# Altium schematic sheet Matrix.SchDoc
size B
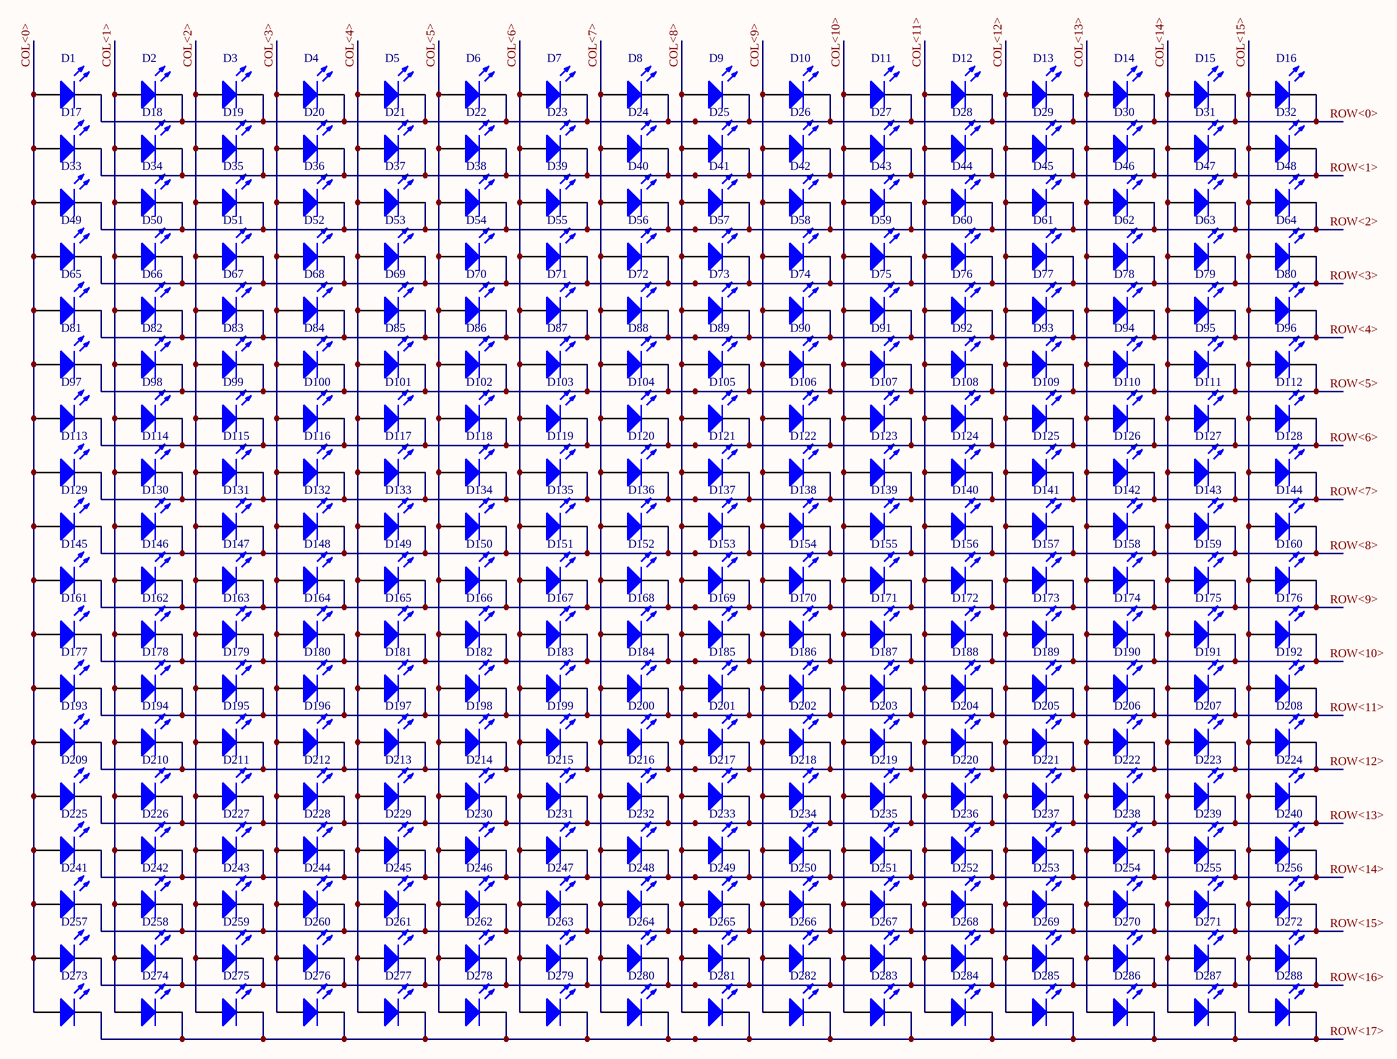
[diagram p0: Matrix.SchDoc]

## Parts
D1  (no value)  [LED-UPRIGHT]
D2  (no value)  [LED-UPRIGHT]
D3  (no value)  [LED-UPRIGHT]
D4  (no value)  [LED-UPRIGHT]
D5  (no value)  [LED-UPRIGHT]
D6  (no value)  [LED-UPRIGHT]
D7  (no value)  [LED-UPRIGHT]
D8  (no value)  [LED-UPRIGHT]
D9  (no value)  [LED-UPRIGHT]
D10  (no value)  [LED-UPRIGHT]
D11  (no value)  [LED-UPRIGHT]
D12  (no value)  [LED-UPRIGHT]
D13  (no value)  [LED-UPRIGHT]
D14  (no value)  [LED-UPRIGHT]
D15  (no value)  [LED-UPRIGHT]
D16  (no value)  [LED-UPRIGHT]
D17  (no value)  [LED-UPRIGHT]
D18  (no value)  [LED-UPRIGHT]
D19  (no value)  [LED-UPRIGHT]
D20  (no value)  [LED-UPRIGHT]
D21  (no value)  [LED-UPRIGHT]
D22  (no value)  [LED-UPRIGHT]
D23  (no value)  [LED-UPRIGHT]
D24  (no value)  [LED-UPRIGHT]
D25  (no value)  [LED-UPRIGHT]
D26  (no value)  [LED-UPRIGHT]
D27  (no value)  [LED-UPRIGHT]
D28  (no value)  [LED-UPRIGHT]
D29  (no value)  [LED-UPRIGHT]
D30  (no value)  [LED-UPRIGHT]
D31  (no value)  [LED-UPRIGHT]
D32  (no value)  [LED-UPRIGHT]
D33  (no value)  [LED-UPRIGHT]
D34  (no value)  [LED-UPRIGHT]
D35  (no value)  [LED-UPRIGHT]
D36  (no value)  [LED-UPRIGHT]
D37  (no value)  [LED-UPRIGHT]
D38  (no value)  [LED-UPRIGHT]
D39  (no value)  [LED-UPRIGHT]
D40  (no value)  [LED-UPRIGHT]
D41  (no value)  [LED-UPRIGHT]
D42  (no value)  [LED-UPRIGHT]
D43  (no value)  [LED-UPRIGHT]
D44  (no value)  [LED-UPRIGHT]
D45  (no value)  [LED-UPRIGHT]
D46  (no value)  [LED-UPRIGHT]
D47  (no value)  [LED-UPRIGHT]
D48  (no value)  [LED-UPRIGHT]
D49  (no value)  [LED-UPRIGHT]
D50  (no value)  [LED-UPRIGHT]
D51  (no value)  [LED-UPRIGHT]
D52  (no value)  [LED-UPRIGHT]
D53  (no value)  [LED-UPRIGHT]
D54  (no value)  [LED-UPRIGHT]
D55  (no value)  [LED-UPRIGHT]
D56  (no value)  [LED-UPRIGHT]
D57  (no value)  [LED-UPRIGHT]
D58  (no value)  [LED-UPRIGHT]
D59  (no value)  [LED-UPRIGHT]
D60  (no value)  [LED-UPRIGHT]
D61  (no value)  [LED-UPRIGHT]
D62  (no value)  [LED-UPRIGHT]
D63  (no value)  [LED-UPRIGHT]
D64  (no value)  [LED-UPRIGHT]
D65  (no value)  [LED-UPRIGHT]
D66  (no value)  [LED-UPRIGHT]
D67  (no value)  [LED-UPRIGHT]
D68  (no value)  [LED-UPRIGHT]
D69  (no value)  [LED-UPRIGHT]
D70  (no value)  [LED-UPRIGHT]
D71  (no value)  [LED-UPRIGHT]
D72  (no value)  [LED-UPRIGHT]
D73  (no value)  [LED-UPRIGHT]
D74  (no value)  [LED-UPRIGHT]
D75  (no value)  [LED-UPRIGHT]
D76  (no value)  [LED-UPRIGHT]
D77  (no value)  [LED-UPRIGHT]
D78  (no value)  [LED-UPRIGHT]
D79  (no value)  [LED-UPRIGHT]
D80  (no value)  [LED-UPRIGHT]
D81  (no value)  [LED-UPRIGHT]
D82  (no value)  [LED-UPRIGHT]
D83  (no value)  [LED-UPRIGHT]
D84  (no value)  [LED-UPRIGHT]
D85  (no value)  [LED-UPRIGHT]
D86  (no value)  [LED-UPRIGHT]
D87  (no value)  [LED-UPRIGHT]
D88  (no value)  [LED-UPRIGHT]
D89  (no value)  [LED-UPRIGHT]
D90  (no value)  [LED-UPRIGHT]
D91  (no value)  [LED-UPRIGHT]
D92  (no value)  [LED-UPRIGHT]
D93  (no value)  [LED-UPRIGHT]
D94  (no value)  [LED-UPRIGHT]
D95  (no value)  [LED-UPRIGHT]
D96  (no value)  [LED-UPRIGHT]
D97  (no value)  [LED-UPRIGHT]
D98  (no value)  [LED-UPRIGHT]
D99  (no value)  [LED-UPRIGHT]
D100  (no value)  [LED-UPRIGHT]
D101  (no value)  [LED-UPRIGHT]
D102  (no value)  [LED-UPRIGHT]
D103  (no value)  [LED-UPRIGHT]
D104  (no value)  [LED-UPRIGHT]
D105  (no value)  [LED-UPRIGHT]
D106  (no value)  [LED-UPRIGHT]
D107  (no value)  [LED-UPRIGHT]
D108  (no value)  [LED-UPRIGHT]
D109  (no value)  [LED-UPRIGHT]
D110  (no value)  [LED-UPRIGHT]
D111  (no value)  [LED-UPRIGHT]
D112  (no value)  [LED-UPRIGHT]
D113  (no value)  [LED-UPRIGHT]
D114  (no value)  [LED-UPRIGHT]
D115  (no value)  [LED-UPRIGHT]
D116  (no value)  [LED-UPRIGHT]
D117  (no value)  [LED-UPRIGHT]
D118  (no value)  [LED-UPRIGHT]
D119  (no value)  [LED-UPRIGHT]
D120  (no value)  [LED-UPRIGHT]
D121  (no value)  [LED-UPRIGHT]
D122  (no value)  [LED-UPRIGHT]
D123  (no value)  [LED-UPRIGHT]
D124  (no value)  [LED-UPRIGHT]
D125  (no value)  [LED-UPRIGHT]
D126  (no value)  [LED-UPRIGHT]
D127  (no value)  [LED-UPRIGHT]
D128  (no value)  [LED-UPRIGHT]
D129  (no value)  [LED-UPRIGHT]
D130  (no value)  [LED-UPRIGHT]
D131  (no value)  [LED-UPRIGHT]
D132  (no value)  [LED-UPRIGHT]
D133  (no value)  [LED-UPRIGHT]
D134  (no value)  [LED-UPRIGHT]
D135  (no value)  [LED-UPRIGHT]
D136  (no value)  [LED-UPRIGHT]
D137  (no value)  [LED-UPRIGHT]
D138  (no value)  [LED-UPRIGHT]
D139  (no value)  [LED-UPRIGHT]
D140  (no value)  [LED-UPRIGHT]
D141  (no value)  [LED-UPRIGHT]
D142  (no value)  [LED-UPRIGHT]
D143  (no value)  [LED-UPRIGHT]
D144  (no value)  [LED-UPRIGHT]
D145  (no value)  [LED-UPRIGHT]
D146  (no value)  [LED-UPRIGHT]
D147  (no value)  [LED-UPRIGHT]
D148  (no value)  [LED-UPRIGHT]
D149  (no value)  [LED-UPRIGHT]
D150  (no value)  [LED-UPRIGHT]
D151  (no value)  [LED-UPRIGHT]
D152  (no value)  [LED-UPRIGHT]
D153  (no value)  [LED-UPRIGHT]
D154  (no value)  [LED-UPRIGHT]
D155  (no value)  [LED-UPRIGHT]
D156  (no value)  [LED-UPRIGHT]
D157  (no value)  [LED-UPRIGHT]
D158  (no value)  [LED-UPRIGHT]
D159  (no value)  [LED-UPRIGHT]
D160  (no value)  [LED-UPRIGHT]
D161  (no value)  [LED-UPRIGHT]
D162  (no value)  [LED-UPRIGHT]
D163  (no value)  [LED-UPRIGHT]
D164  (no value)  [LED-UPRIGHT]
D165  (no value)  [LED-UPRIGHT]
D166  (no value)  [LED-UPRIGHT]
D167  (no value)  [LED-UPRIGHT]
D168  (no value)  [LED-UPRIGHT]
D169  (no value)  [LED-UPRIGHT]
D170  (no value)  [LED-UPRIGHT]
D171  (no value)  [LED-UPRIGHT]
D172  (no value)  [LED-UPRIGHT]
D173  (no value)  [LED-UPRIGHT]
D174  (no value)  [LED-UPRIGHT]
D175  (no value)  [LED-UPRIGHT]
D176  (no value)  [LED-UPRIGHT]
D177  (no value)  [LED-UPRIGHT]
D178  (no value)  [LED-UPRIGHT]
D179  (no value)  [LED-UPRIGHT]
D180  (no value)  [LED-UPRIGHT]
D181  (no value)  [LED-UPRIGHT]
D182  (no value)  [LED-UPRIGHT]
D183  (no value)  [LED-UPRIGHT]
D184  (no value)  [LED-UPRIGHT]
D185  (no value)  [LED-UPRIGHT]
D186  (no value)  [LED-UPRIGHT]
D187  (no value)  [LED-UPRIGHT]
D188  (no value)  [LED-UPRIGHT]
D189  (no value)  [LED-UPRIGHT]
D190  (no value)  [LED-UPRIGHT]
D191  (no value)  [LED-UPRIGHT]
D192  (no value)  [LED-UPRIGHT]
D193  (no value)  [LED-UPRIGHT]
D194  (no value)  [LED-UPRIGHT]
D195  (no value)  [LED-UPRIGHT]
D196  (no value)  [LED-UPRIGHT]
D197  (no value)  [LED-UPRIGHT]
D198  (no value)  [LED-UPRIGHT]
D199  (no value)  [LED-UPRIGHT]
D200  (no value)  [LED-UPRIGHT]
D201  (no value)  [LED-UPRIGHT]
D202  (no value)  [LED-UPRIGHT]
D203  (no value)  [LED-UPRIGHT]
D204  (no value)  [LED-UPRIGHT]
D205  (no value)  [LED-UPRIGHT]
D206  (no value)  [LED-UPRIGHT]
D207  (no value)  [LED-UPRIGHT]
D208  (no value)  [LED-UPRIGHT]
D209  (no value)  [LED-UPRIGHT]
D210  (no value)  [LED-UPRIGHT]
D211  (no value)  [LED-UPRIGHT]
D212  (no value)  [LED-UPRIGHT]
D213  (no value)  [LED-UPRIGHT]
D214  (no value)  [LED-UPRIGHT]
D215  (no value)  [LED-UPRIGHT]
D216  (no value)  [LED-UPRIGHT]
D217  (no value)  [LED-UPRIGHT]
D218  (no value)  [LED-UPRIGHT]
D219  (no value)  [LED-UPRIGHT]
D220  (no value)  [LED-UPRIGHT]
D221  (no value)  [LED-UPRIGHT]
D222  (no value)  [LED-UPRIGHT]
D223  (no value)  [LED-UPRIGHT]
D224  (no value)  [LED-UPRIGHT]
D225  (no value)  [LED-UPRIGHT]
D226  (no value)  [LED-UPRIGHT]
D227  (no value)  [LED-UPRIGHT]
D228  (no value)  [LED-UPRIGHT]
D229  (no value)  [LED-UPRIGHT]
D230  (no value)  [LED-UPRIGHT]
D231  (no value)  [LED-UPRIGHT]
D232  (no value)  [LED-UPRIGHT]
D233  (no value)  [LED-UPRIGHT]
D234  (no value)  [LED-UPRIGHT]
D235  (no value)  [LED-UPRIGHT]
D236  (no value)  [LED-UPRIGHT]
D237  (no value)  [LED-UPRIGHT]
D238  (no value)  [LED-UPRIGHT]
D239  (no value)  [LED-UPRIGHT]
D240  (no value)  [LED-UPRIGHT]
D241  (no value)  [LED-UPRIGHT]
D242  (no value)  [LED-UPRIGHT]
D243  (no value)  [LED-UPRIGHT]
D244  (no value)  [LED-UPRIGHT]
D245  (no value)  [LED-UPRIGHT]
D246  (no value)  [LED-UPRIGHT]
D247  (no value)  [LED-UPRIGHT]
D248  (no value)  [LED-UPRIGHT]
D249  (no value)  [LED-UPRIGHT]
D250  (no value)  [LED-UPRIGHT]
D251  (no value)  [LED-UPRIGHT]
D252  (no value)  [LED-UPRIGHT]
D253  (no value)  [LED-UPRIGHT]
D254  (no value)  [LED-UPRIGHT]
D255  (no value)  [LED-UPRIGHT]
D256  (no value)  [LED-UPRIGHT]
D257  (no value)  [LED-UPRIGHT]
D258  (no value)  [LED-UPRIGHT]
D259  (no value)  [LED-UPRIGHT]
D260  (no value)  [LED-UPRIGHT]
D261  (no value)  [LED-UPRIGHT]
D262  (no value)  [LED-UPRIGHT]
D263  (no value)  [LED-UPRIGHT]
D264  (no value)  [LED-UPRIGHT]
D265  (no value)  [LED-UPRIGHT]
D266  (no value)  [LED-UPRIGHT]
D267  (no value)  [LED-UPRIGHT]
D268  (no value)  [LED-UPRIGHT]
D269  (no value)  [LED-UPRIGHT]
D270  (no value)  [LED-UPRIGHT]
D271  (no value)  [LED-UPRIGHT]
D272  (no value)  [LED-UPRIGHT]
D273  (no value)  [LED-UPRIGHT]
D274  (no value)  [LED-UPRIGHT]
D275  (no value)  [LED-UPRIGHT]
D276  (no value)  [LED-UPRIGHT]
D277  (no value)  [LED-UPRIGHT]
D278  (no value)  [LED-UPRIGHT]
D279  (no value)  [LED-UPRIGHT]
D280  (no value)  [LED-UPRIGHT]
D281  (no value)  [LED-UPRIGHT]
D282  (no value)  [LED-UPRIGHT]
D283  (no value)  [LED-UPRIGHT]
D284  (no value)  [LED-UPRIGHT]
D285  (no value)  [LED-UPRIGHT]
D286  (no value)  [LED-UPRIGHT]
D287  (no value)  [LED-UPRIGHT]
D288  (no value)  [LED-UPRIGHT]

## Nets
COL<0>: D1.1(A) D17.1(A) D33.1(A) D49.1(A) D65.1(A) D81.1(A) D97.1(A) D113.1(A) D129.1(A) D145.1(A) D161.1(A) D177.1(A) D193.1(A) D209.1(A) D225.1(A) D241.1(A) D257.1(A) D273.1(A)
COL<1>: D2.1(A) D18.1(A) D34.1(A) D50.1(A) D66.1(A) D82.1(A) D98.1(A) D114.1(A) D130.1(A) D146.1(A) D162.1(A) D178.1(A) D194.1(A) D210.1(A) D226.1(A) D242.1(A) D258.1(A) D274.1(A)
COL<2>: D3.1(A) D19.1(A) D35.1(A) D51.1(A) D67.1(A) D83.1(A) D99.1(A) D115.1(A) D131.1(A) D147.1(A) D163.1(A) D179.1(A) D195.1(A) D211.1(A) D227.1(A) D243.1(A) D259.1(A) D275.1(A)
COL<3>: D4.1(A) D20.1(A) D36.1(A) D52.1(A) D68.1(A) D84.1(A) D100.1(A) D116.1(A) D132.1(A) D148.1(A) D164.1(A) D180.1(A) D196.1(A) D212.1(A) D228.1(A) D244.1(A) D260.1(A) D276.1(A)
COL<4>: D5.1(A) D21.1(A) D37.1(A) D53.1(A) D69.1(A) D85.1(A) D101.1(A) D117.1(A) D133.1(A) D149.1(A) D165.1(A) D181.1(A) D197.1(A) D213.1(A) D229.1(A) D245.1(A) D261.1(A) D277.1(A)
COL<5>: D6.1(A) D22.1(A) D38.1(A) D54.1(A) D70.1(A) D86.1(A) D102.1(A) D118.1(A) D134.1(A) D150.1(A) D166.1(A) D182.1(A) D198.1(A) D214.1(A) D230.1(A) D246.1(A) D262.1(A) D278.1(A)
COL<6>: D7.1(A) D23.1(A) D39.1(A) D55.1(A) D71.1(A) D87.1(A) D103.1(A) D119.1(A) D135.1(A) D151.1(A) D167.1(A) D183.1(A) D199.1(A) D215.1(A) D231.1(A) D247.1(A) D263.1(A) D279.1(A)
COL<7>: D8.1(A) D24.1(A) D40.1(A) D56.1(A) D72.1(A) D88.1(A) D104.1(A) D120.1(A) D136.1(A) D152.1(A) D168.1(A) D184.1(A) D200.1(A) D216.1(A) D232.1(A) D248.1(A) D264.1(A) D280.1(A)
COL<8>: D9.1(A) D25.1(A) D41.1(A) D57.1(A) D73.1(A) D89.1(A) D105.1(A) D121.1(A) D137.1(A) D153.1(A) D169.1(A) D185.1(A) D201.1(A) D217.1(A) D233.1(A) D249.1(A) D265.1(A) D281.1(A)
COL<9>: D10.1(A) D26.1(A) D42.1(A) D58.1(A) D74.1(A) D90.1(A) D106.1(A) D122.1(A) D138.1(A) D154.1(A) D170.1(A) D186.1(A) D202.1(A) D218.1(A) D234.1(A) D250.1(A) D266.1(A) D282.1(A)
COL<10>: D11.1(A) D27.1(A) D43.1(A) D59.1(A) D75.1(A) D91.1(A) D107.1(A) D123.1(A) D139.1(A) D155.1(A) D171.1(A) D187.1(A) D203.1(A) D219.1(A) D235.1(A) D251.1(A) D267.1(A) D283.1(A)
COL<11>: D12.1(A) D28.1(A) D44.1(A) D60.1(A) D76.1(A) D92.1(A) D108.1(A) D124.1(A) D140.1(A) D156.1(A) D172.1(A) D188.1(A) D204.1(A) D220.1(A) D236.1(A) D252.1(A) D268.1(A) D284.1(A)
COL<12>: D13.1(A) D29.1(A) D45.1(A) D61.1(A) D77.1(A) D93.1(A) D109.1(A) D125.1(A) D141.1(A) D157.1(A) D173.1(A) D189.1(A) D205.1(A) D221.1(A) D237.1(A) D253.1(A) D269.1(A) D285.1(A)
COL<13>: D14.1(A) D30.1(A) D46.1(A) D62.1(A) D78.1(A) D94.1(A) D110.1(A) D126.1(A) D142.1(A) D158.1(A) D174.1(A) D190.1(A) D206.1(A) D222.1(A) D238.1(A) D254.1(A) D270.1(A) D286.1(A)
COL<14>: D15.1(A) D31.1(A) D47.1(A) D63.1(A) D79.1(A) D95.1(A) D111.1(A) D127.1(A) D143.1(A) D159.1(A) D175.1(A) D191.1(A) D207.1(A) D223.1(A) D239.1(A) D255.1(A) D271.1(A) D287.1(A)
COL<15>: D16.1(A) D32.1(A) D48.1(A) D64.1(A) D80.1(A) D96.1(A) D112.1(A) D128.1(A) D144.1(A) D160.1(A) D176.1(A) D192.1(A) D208.1(A) D224.1(A) D240.1(A) D256.1(A) D272.1(A) D288.1(A)
ROW<0>: D1.2(K) D2.2(K) D3.2(K) D4.2(K) D5.2(K) D6.2(K) D7.2(K) D8.2(K) D9.2(K) D10.2(K) D11.2(K) D12.2(K) D13.2(K) D14.2(K) D15.2(K) D16.2(K)
ROW<1>: D17.2(K) D18.2(K) D19.2(K) D20.2(K) D21.2(K) D22.2(K) D23.2(K) D24.2(K) D25.2(K) D26.2(K) D27.2(K) D28.2(K) D29.2(K) D30.2(K) D31.2(K) D32.2(K)
ROW<2>: D33.2(K) D34.2(K) D35.2(K) D36.2(K) D37.2(K) D38.2(K) D39.2(K) D40.2(K) D41.2(K) D42.2(K) D43.2(K) D44.2(K) D45.2(K) D46.2(K) D47.2(K) D48.2(K)
ROW<3>: D49.2(K) D50.2(K) D51.2(K) D52.2(K) D53.2(K) D54.2(K) D55.2(K) D56.2(K) D57.2(K) D58.2(K) D59.2(K) D60.2(K) D61.2(K) D62.2(K) D63.2(K) D64.2(K)
ROW<4>: D65.2(K) D66.2(K) D67.2(K) D68.2(K) D69.2(K) D70.2(K) D71.2(K) D72.2(K) D73.2(K) D74.2(K) D75.2(K) D76.2(K) D77.2(K) D78.2(K) D79.2(K) D80.2(K)
ROW<5>: D81.2(K) D82.2(K) D83.2(K) D84.2(K) D85.2(K) D86.2(K) D87.2(K) D88.2(K) D89.2(K) D90.2(K) D91.2(K) D92.2(K) D93.2(K) D94.2(K) D95.2(K) D96.2(K)
ROW<6>: D97.2(K) D98.2(K) D99.2(K) D100.2(K) D101.2(K) D102.2(K) D103.2(K) D104.2(K) D105.2(K) D106.2(K) D107.2(K) D108.2(K) D109.2(K) D110.2(K) D111.2(K) D112.2(K)
ROW<7>: D113.2(K) D114.2(K) D115.2(K) D116.2(K) D117.2(K) D118.2(K) D119.2(K) D120.2(K) D121.2(K) D122.2(K) D123.2(K) D124.2(K) D125.2(K) D126.2(K) D127.2(K) D128.2(K)
ROW<8>: D129.2(K) D130.2(K) D131.2(K) D132.2(K) D133.2(K) D134.2(K) D135.2(K) D136.2(K) D137.2(K) D138.2(K) D139.2(K) D140.2(K) D141.2(K) D142.2(K) D143.2(K) D144.2(K)
ROW<9>: D145.2(K) D146.2(K) D147.2(K) D148.2(K) D149.2(K) D150.2(K) D151.2(K) D152.2(K) D153.2(K) D154.2(K) D155.2(K) D156.2(K) D157.2(K) D158.2(K) D159.2(K) D160.2(K)
ROW<10>: D161.2(K) D162.2(K) D163.2(K) D164.2(K) D165.2(K) D166.2(K) D167.2(K) D168.2(K) D169.2(K) D170.2(K) D171.2(K) D172.2(K) D173.2(K) D174.2(K) D175.2(K) D176.2(K)
ROW<11>: D177.2(K) D178.2(K) D179.2(K) D180.2(K) D181.2(K) D182.2(K) D183.2(K) D184.2(K) D185.2(K) D186.2(K) D187.2(K) D188.2(K) D189.2(K) D190.2(K) D191.2(K) D192.2(K)
ROW<12>: D193.2(K) D194.2(K) D195.2(K) D196.2(K) D197.2(K) D198.2(K) D199.2(K) D200.2(K) D201.2(K) D202.2(K) D203.2(K) D204.2(K) D205.2(K) D206.2(K) D207.2(K) D208.2(K)
ROW<13>: D209.2(K) D210.2(K) D211.2(K) D212.2(K) D213.2(K) D214.2(K) D215.2(K) D216.2(K) D217.2(K) D218.2(K) D219.2(K) D220.2(K) D221.2(K) D222.2(K) D223.2(K) D224.2(K)
ROW<14>: D225.2(K) D226.2(K) D227.2(K) D228.2(K) D229.2(K) D230.2(K) D231.2(K) D232.2(K) D233.2(K) D234.2(K) D235.2(K) D236.2(K) D237.2(K) D238.2(K) D239.2(K) D240.2(K)
ROW<15>: D241.2(K) D242.2(K) D243.2(K) D244.2(K) D245.2(K) D246.2(K) D247.2(K) D248.2(K) D249.2(K) D250.2(K) D251.2(K) D252.2(K) D253.2(K) D254.2(K) D255.2(K) D256.2(K)
ROW<16>: D257.2(K) D258.2(K) D259.2(K) D260.2(K) D261.2(K) D262.2(K) D263.2(K) D264.2(K) D265.2(K) D266.2(K) D267.2(K) D268.2(K) D269.2(K) D270.2(K) D271.2(K) D272.2(K)
ROW<17>: D273.2(K) D274.2(K) D275.2(K) D276.2(K) D277.2(K) D278.2(K) D279.2(K) D280.2(K) D281.2(K) D282.2(K) D283.2(K) D284.2(K) D285.2(K) D286.2(K) D287.2(K) D288.2(K)

## Library data of the parts
D1-D288 = LED0: Typical INFRARED GaAs LED; Manufacturer: Generic Components; Class I: Optoelectronic; Published: 8-Jun-2000; Revision: July-2002: Re-released for DXP Platform.; Publisher: Altium Limited; Class II: LED